# Altium schematic sheet Communication.SchDoc
size 420 x 297 mm; SheetNumber: 3; SheetTotal: 6
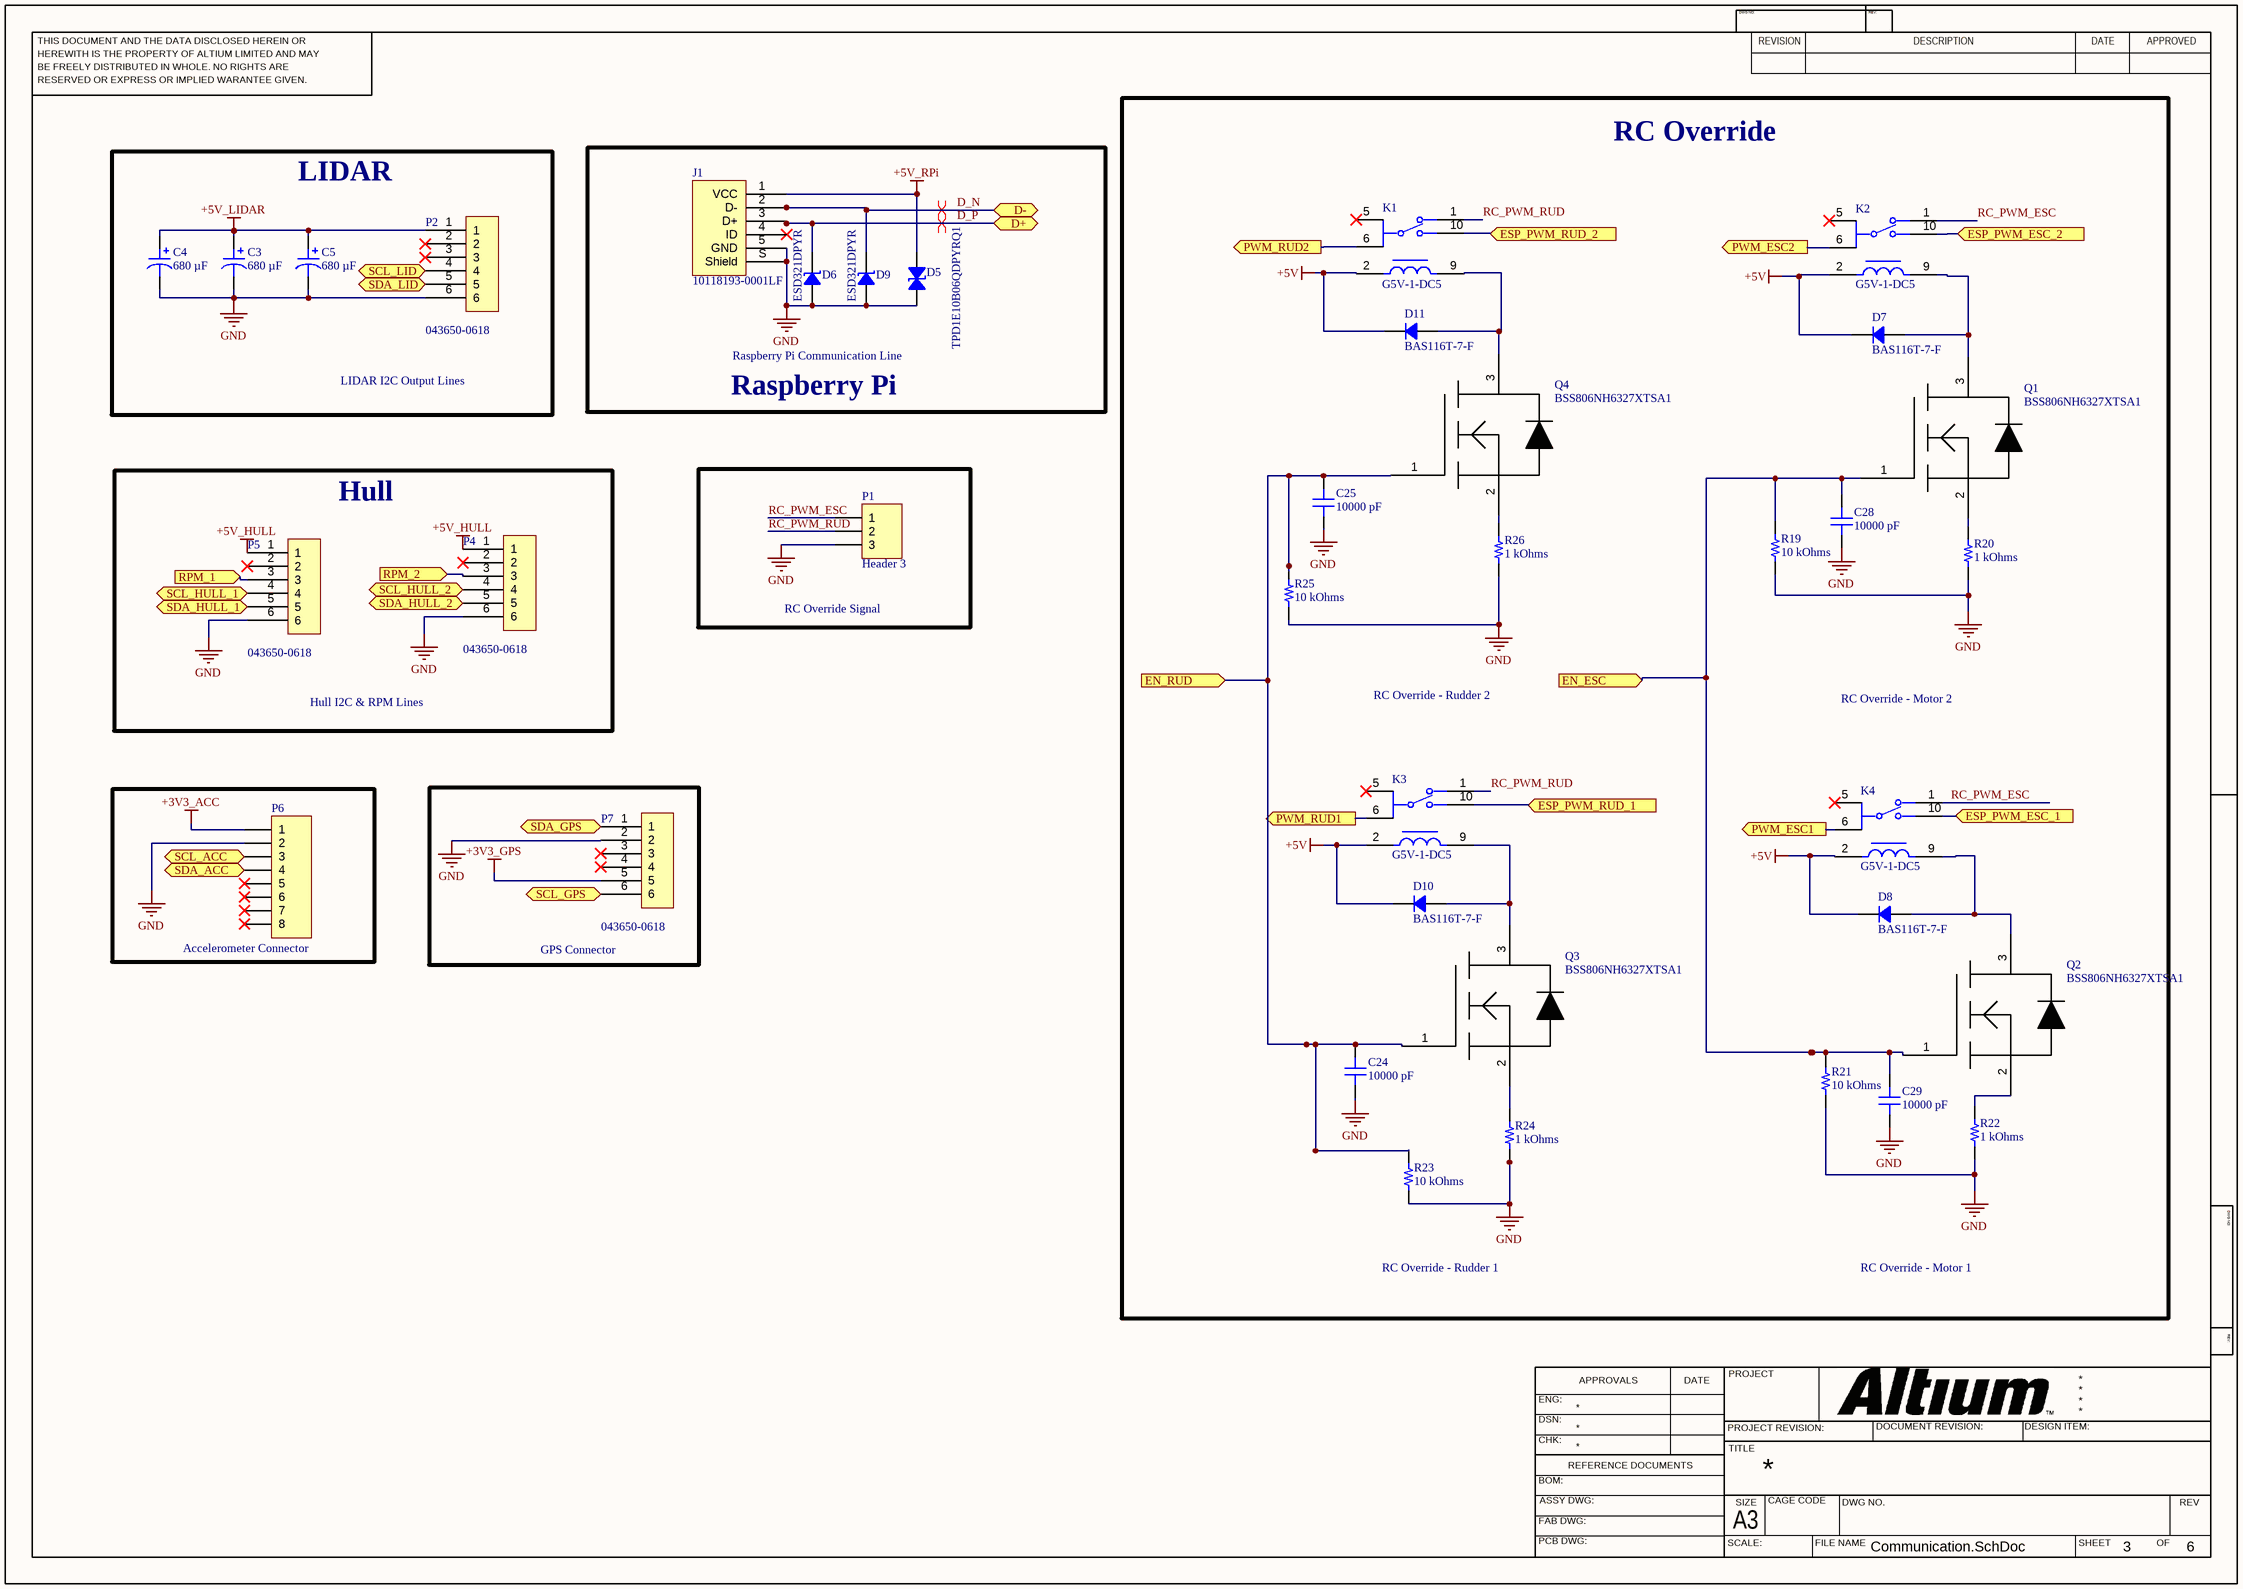
[diagram p0: Communication.SchDoc]

## Parts
C3  680 µF  [CAP ALSMD 8.3MM H10.5MM]
C4  680 µF  [CAP ALSMD 8.3MM H10.5MM]
C5  680 µF  [CAP ALSMD 8.3MM H10.5MM]
C24  10000 pF  [CAP 0603_1608]
C25  10000 pF  [CAP 0603_1608]
C28  10000 pF  [CAP 0603_1608]
C29  10000 pF  [CAP 0603_1608]
D5  TPD1E10B06QDPYRQ1  [0402]
D6  ESD321DPYR  [0402]
D7  BAS116T-7-F  [DIODES SOT-523]
D8  BAS116T-7-F  [DIODES SOT-523]
D9  ESD321DPYR  [0402]
D10  BAS116T-7-F  [DIODES SOT-523]
D11  BAS116T-7-F  [DIODES SOT-523]
J1  10118193-0001LF  [FCI USB 10118193-0001LF]
K1  G5V-1-DC5  [FP-G5V-1-MFG]
K2  G5V-1-DC5  [FP-G5V-1-MFG]
K3  G5V-1-DC5  [FP-G5V-1-MFG]
K4  G5V-1-DC5  [FP-G5V-1-MFG]
P1  Header 3  [HDR1X3]
P2  043650-0618  [043650-0618-Footprint-1]
P4  043650-0618  [043650-0618-Footprint-1]
P5  043650-0618  [043650-0618-Footprint-1]
P6  Accelerometer Connector  [HDR1X8]
P7  043650-0618  [043650-0618-Footprint-1]
Q1  BSS806NH6327XTSA1  [SOT95P255X100-3N]
Q2  BSS806NH6327XTSA1  [SOT95P255X100-3N]
Q3  BSS806NH6327XTSA1  [SOT95P255X100-3N]
Q4  BSS806NH6327XTSA1  [SOT95P255X100-3N]
R19  10 kOhms  [RES 0603_1608]
R20  1 kOhms  [RES 0603_1608]
R21  10 kOhms  [RES 0603_1608]
R22  1 kOhms  [RES 0603_1608]
R23  10 kOhms  [RES 0603_1608]
R24  1 kOhms  [RES 0603_1608]
R25  10 kOhms  [RES 0603_1608]
R26  1 kOhms  [RES 0603_1608]

## Blocks framed on the sheet
RC Override: C24 C25 C28 C29 D7 D8 D10 D11 K1-K4 Q1-Q4 R19-R26
LIDAR: C3-C5 P2
Raspberry Pi: D5 D6 D9 J1
Hull: P4 P5
RC Override Signal: P1
GPS Connector: P7

## Ports
D+ (bidir), D- (bidir), EN_ESC (in), EN_RUD (in), ESP_PWM_ESC_1 (in), ESP_PWM_ESC_2 (in), ESP_PWM_RUD_1 (in), ESP_PWM_RUD_2 (in), PWM_ESC1 (out), PWM_ESC2 (out), PWM_RUD1 (out), PWM_RUD2 (out), RPM_1 (in), RPM_2 (in), SCL_ACC (bidir), SCL_GPS (bidir), SCL_HULL_1 (bidir), SCL_HULL_2 (bidir), SCL_LID (bidir), SDA_ACC (bidir), SDA_GPS (bidir), SDA_HULL_1 (bidir), SDA_HULL_2 (bidir), SDA_LID (bidir)

## Nets
+3V3_ACC: P6.1
+3V3_GPS: P7.5
+5V: D7.2 D8.2 D10.2 D11.2 K1.2 K2.2 K3.2 K4.2
+5V_HULL: P4.1 P5.1
+5V_LIDAR: C3.1 C4.1 C5.1 P2.1
+5V_RPi: D5.1 J1.1(VCC)
GND: C3.2 C4.2 C5.2 C24.2 C25.2 C28.2 C29.2 D5.2 D6.1 D9.1 J1.5(GND) J1.S(Shield) P1.3 P2.6 P4.6 P5.6 P6.2 P7.2 R19.1 R20.1 R21.1 R22.1 R23.1 R24.1 R25.1 R26.1
D_N: D9.2 J1.2(D-) ; port D-
D_P: D6.2 J1.3(D+) ; port D+
EN_ESC: C28.1 C29.1 Q1.1(GATE) Q2.1(GATE) R19.2 R21.2 ; port EN_ESC
EN_RUD: C24.1 C25.1 Q3.1(GATE) Q4.1(GATE) R23.2 R25.2 ; port EN_RUD
ESP_PWM_ESC_1: K4.10 ; port ESP_PWM_ESC_1
ESP_PWM_ESC_2: K2.10 ; port ESP_PWM_ESC_2
ESP_PWM_RUD_1: K3.10 ; port ESP_PWM_RUD_1
ESP_PWM_RUD_2: K1.10 ; port ESP_PWM_RUD_2
PWM_ESC1: K4.6 ; port PWM_ESC1
PWM_ESC2: K2.6 ; port PWM_ESC2
PWM_RUD1: K3.6 ; port PWM_RUD1
PWM_RUD2: K1.6 ; port PWM_RUD2
RC_PWM_ESC: K2.1 K4.1 P1.1
RC_PWM_RUD: K1.1 K3.1 P1.2
RPM_1: P5.3 ; port RPM_1
RPM_2: P4.3 ; port RPM_2
SCL_ACC: P6.3 ; port SCL_ACC
SCL_GPS: P7.6 ; port SCL_GPS
SCL_HULL_1: P5.4 ; port SCL_HULL_1
SCL_HULL_2: P4.4 ; port SCL_HULL_2
SCL_LID: P2.4 ; port SCL_LID
SDA_ACC: P6.4 ; port SDA_ACC
SDA_GPS: P7.1 ; port SDA_GPS
SDA_HULL_1: P5.5 ; port SDA_HULL_1
SDA_HULL_2: P4.5 ; port SDA_HULL_2
SDA_LID: P2.5 ; port SDA_LID
NetD7_1: D7.1 K2.9 Q1.3(DRAIN)
NetD8_1: D8.1 K4.9 Q2.3(DRAIN)
NetD10_1: D10.1 K3.9 Q3.3(DRAIN)
NetD11_1: D11.1 K1.9 Q4.3(DRAIN)
NetQ1_2: Q1.2(SOURCE) R20.2
NetQ2_2: Q2.2(SOURCE) R22.2
NetQ3_2: Q3.2(SOURCE) R24.2
NetQ4_2: Q4.2(SOURCE) R26.2

Not connected (* = marked no-connect by the designer): J1 4(ID)*; K1 5*; K2 5*; K3 5*; K4 5*; P2 2* 3*; P4 2*; P5 2*; P6 5* 6* 7* 8*; P7 3* 4*

## Layout directives
differential pair: D_N, D_P

## Notes on the sheet
- LIDAR I2C Output Lines
- Raspberry Pi Communication Line
- Hull I2C & RPM Lines
- RC Override - Rudder 2
- RC Override - Motor 2
- RC Override - Rudder 1
- RC Override - Motor 1
- THIS DOCUMENT AND THE DATA DISCLOSED HEREIN OR
- HEREWITH IS THE PROPERTY OF ALTIUM LIMITED AND MAY
- DWG NO:
- REVISION
- REV:
- DESCRIPTION
- DATE
- APPROVED
- BE FREELY DISTRIBUTED IN WHOLE. NO RIGHTS ARE
- RESERVED OR EXPRESS OR IMPLIED WARANTEE GIVEN.
- ENG:
- APPROVALS
- PROJECT
- DSN:
- CHK:
- REFERENCE DOCUMENTS
- PROJECT REVISION:
- TITLE
- DOCUMENT REVISION:
- DESIGN ITEM:
- BOM:
- FAB DWG:
- PCB DWG:
- ASSY DWG:
- SCALE:
- A3
- SIZE
- CAGE CODE
- FILE NAME
- DWG NO.
- SHEET
- OF
- REV

## Library data of the parts
C3-C5 = EEE-FK1A681P: CAP ALUM 680UF 20% 10V SMD; manufacturer: Panasonic Electronic Components; Impedance: 160 mOhms; Lifetime @ Temp.: 2000 Hrs @ 105°C; Polarization: Polar; Ripple Current @ High Frequency: 600 mA @ 100 kHz; Ripple Current @ Low Frequency: 450 mA @ 120 Hz; Surface Mount Land Size: 0.327" L x 0.327" W (8.30mm x 8.30mm); Part Number: EEE-FK1A681P; Applications: Automotive; Capacitance: 680 µF; componentlink2description: DigiKey Link; componentlink2url: https://www.digikey.com/en/products/detail/panasonic-electronic-components/EEE-FK1A681P/765951; Device Package: Radial, Can - SMD; Height - Seated (Max): 0.413" (10.50mm); lastupdated: 3/4/2022 6:18:28 PM; Lifecycle Status: Active; Minimum Order: 1; Mounting Type: Surface Mount; Operating Temperature: -55°C ~ 105°C; Package / Case: Radial, Can - SMD; packaging: TapeAndReel; partid: 7615; Part Status: Active; price: 0.34; Ratings: AEC-Q200; series: FK; Size / Dimension: 0.315" Dia (8.00mm); Supplier 1: DigiKey; Supplier Part Number 1: PCE3781CT-ND; Tolerance: ±20%; value: 680 µF; Voltage - Rated: 10 V
C24 C25 C28 C29 = C0603C103K4RECAUTO: CAP CER 0603 10NF 16V X7R 10%; manufacturer: KEMET; Part Number: C0603C103K4RECAUTO; Value: 10000 pF; Applications: Automotive, ESD Protection; Capacitance: 10000 pF; componentlink1description: Datasheet; componentlink1url: https://api.kemet.com/component-edge/download/datasheet/C0603C103K4RECAUTO.pdf; componentlink2description: DigiKey Link; componentlink2url: https://www.digikey.com/en/products/detail/kemet/C0603C103K4RECAUTO/8640474; Device Package: 0603 (1608 Metric); lastupdated: 2022-06-14 2:44:13 AM; Lifecycle Status: Active; Minimum Order: 1; Mounting Type: Surface Mount, MLCC; Operating Temperature: -55°C ~ 125°C; Package / Case: 0603 (1608 Metric); packaging: TapeAndReel; partid: 8251; Part Status: Active; price: 0.02; Ratings: AEC-Q200; series: ESD SMD Auto X7R; Size / Dimension: 0.063" L x 0.031" W (1.60mm x 0.80mm); Supplier 1: DigiKey; Supplier Part Number 1: 399-17880-1-ND; Temperature Coefficient: X7R; Thickness (Max): 0.034" (0.87mm); Tolerance: ±10%; Voltage - Rated: 16V
D5 = TPD1E10B06QDPYRQ1: TVS DIODE 5.5VWM 14VC 2X1SON; Manufacturer: Texas Instruments; Bidirectional Channels: 1; Capacitance @ Frequency: 12pF @ 1MHz; Current - Peak Pulse (10/1000µs): 6A (8/20µs); Power Line Protection: No; Power - Peak Pulse: 90W; Type: Zener; Voltage - Breakdown (Min): 6V; Voltage - Clamping (Max) @ Ipp: 14V (Typ); Voltage - Reverse Standoff (Typ): 5.5V (Max); Part Number: TPD1E10B06QDPYRQ1; Applications: Automotive; ComponentLink1Description: Datasheet; ComponentLink1URL: http://www.ti.com/general/docs/suppproductinfo.tsp?distId=10&gotoUrl=http%3A%2F%2Fwww.ti.com%2Flit%2Fgpn%2Ftpd1e10b06-q1; ComponentLink2Description: DigiKey Link; ComponentLink2URL: https://www.digikey.com/en/products/detail/texas-instruments/TPD1E10B06QDPYRQ1/6609845; Device Package: 0402 (1005 Metric); LastUpdated: 2022-09-19 2:05:54 PM; Lifecycle Status: Active; Minimum Order: 1; Mounting Type: Surface Mount; Operating Temperature: -40°C ~ 125°C (TA); Package / Case: 0402 (1005 Metric); Packaging: TapeAndReel; PartId: 10475; Part Status: Active; Price: 0.09; Series: Automotive, AEC-Q101; Supplier 1: DigiKey; Supplier Part Number 1: 296-TPD1E10B06QDPYRQ1CT-ND; Supplier Device Package: 2-X1SON (1x.60)
D6 D9 = ESD321DPYR: TVS DIODE 3.6VWM 6.8VC 2X1SON; Manufacturer: Texas Instruments; Capacitance @ Frequency: 0.9pF @ 1MHz; Current - Peak Pulse (10/1000µs): 6A (8/20µs); Power Line Protection: No; Power - Peak Pulse: 40W; Type: Zener; Unidirectional Channels: 1; Voltage - Breakdown (Min): 4.5V; Voltage - Clamping (Max) @ Ipp: 6.8V (Typ); Voltage - Reverse Standoff (Typ): 3.6V (Max); Part Number: ESD321DPYR; Applications: General Purpose; ComponentLink1Description: Datasheet; ComponentLink1URL: http://www.ti.com/general/docs/suppproductinfo.tsp?distId=10&gotoUrl=http%3A%2F%2Fwww.ti.com%2Flit%2Fgpn%2Fesd321; ComponentLink2Description: DigiKey Link; ComponentLink2URL: https://www.digikey.com/en/products/detail/texas-instruments/ESD321DPYR/9559035; Device Package: 0402 (1005 Metric); LastUpdated: 2022-09-19 2:05:48 PM; Lifecycle Status: Active; Minimum Order: 1; Mounting Type: Surface Mount; Operating Temperature: -40°C ~ 125°C (TA); Package / Case: 0402 (1005 Metric); Packaging: TapeAndReel; PartId: 11534; Part Status: Active; Price: 0.10; Series: -; Supplier 1: DigiKey; Supplier Part Number 1: 296-51108-1-ND; Supplier Device Package: 2-X1SON (1x.60)
D7 D8 D10 D11 = BAS116T-7-F: DIODE GEN PURP 85V 215MA SOT523; Manufacturer: Diodes Incorporated; Current - Average Rectified (Io): 215mA (DC); Current - Reverse Leakage @ Vr: 5nA @ 75V; Diode Type: Standard; Reverse Recovery Time (trr): 3µs; Speed: Standard Recovery >500ns, > 200mA (Io); Voltage - Forward (Vf) (Max) @ If: 1.25V @ 150mA; Part Number: BAS116T-7-F; ComponentLink1Description: Datasheet; ComponentLink1URL: https://www.diodes.com/assets/Datasheets/ds30258.pdf; ComponentLink2Description: DigiKey Link; ComponentLink2URL: http://digikey.com/product-detail/en/diodes-incorporated/BAS116T-7-F/BAS116T-FDICT-ND/815338; LastUpdated: 4/12/2022 10:52:55 PM; Lifecycle Status: Active; Minimum Order: 1; Mounting Type: Surface Mount; Operating Temperature - Junction: -65°C ~ 150°C; Package / Case: SOT-523; Packaging: TapeAndReel; PartId: 1; Part Status: Active; Price: 0.06; Series: -; Supplier 1: DigiKey; Supplier Part Number 1: BAS116T-FDICT-ND; Supplier Device Package: SOT-523; Voltage - DC Reverse (Vr) (Max): 85V
J1 = 10118193-0001LF: CONN RCPT USB2.0 MICRO B SMD R/A; Manufacturer: Amphenol ICC (FCI); Connector Type: USB - micro B; Current Rating (Amps): 1.8A per Contact; Gender: Receptacle; Mating Cycles: 10000; Number of Contacts: 5; Number of Ports: 1; Shielding: Shielded; Voltage - Rated: 100VAC; Part Number: 10118193-0001LF; ComponentLink1Description: Datasheet; ComponentLink1URL: https://cdn.amphenol-icc.com/media/wysiwyg/files/documentation/datasheet/inputoutput/io_usb_micro.pdf; ComponentLink2Description: DigiKey Link; ComponentLink2URL: //digikey.com/product-detail/en/amphenol-icc-fci/10118193-0001LF/609-4616-2-ND/2785388; Features: Solder Retention; LastUpdated: 2019-12-09 8:51:28 PM; Lifecycle Status: 0; Minimum Order: 1; Mounting Feature: Horizontal; Mounting Type: Surface Mount, Right Angle; Through Hole; Operating Temperature: -30°C ~ 80°C; Packaging: TapeAndReel; Part Status: Active; Price: 0.21; Series: -; Specifications: USB 2.0; Supplier 1: DigiKey; Supplier Part Number 1: 609-4616-2-ND; Termination: Solder
K1-K4 = CMP-2000-05293-2: RELAY GEN PURPOSE SPDT 1A 5VDC; Manufacturer: Omron; Coil Power: 150mW; Coil Voltage: 5V; Standoff Height: 0.5mm; Coil Type: Non-Latching; Coil Resistance: 167Ω; Number Of Contacts: 1; Coil Current: 30mA; Current Rating: 2A; Temperature: -40°C to +70°C; Manufacturer Part Number: G5V-1-DC5; Lead Free: Yes; RoHS: TRUE; Category: Relay; ComponentLink2Description: Datasheet; Ambient Temperature Range Low: -40°C; Digikey Description: RELAY GEN PURPOSE SPDT 1A 5VDC; Temperature Range High: +70°C; Package: G5V-1; Throw Configuration: SPDT; Switching Current: 1A; Height: 10mm; Device Class L2: Relays; Ambient Temperature Range High: +70°C; Temperature Range Low: -40°C; Octopart: https://octopart.com/g5v-1-dc5-omron-6846; Device Class L1: Electromechanical; ComponentLink2URL: https://omronfs.omron.com/en_US/ecb/products/pdf/en-g5v_1.pdf; Automotive: No; Device Class L3: Signal Relays
P1 = Header 3: Header, 3-Pin; LatestRevisionDate: 17-Jul-2002; LatestRevisionNote: Re-released for DXP Platform.; Publisher: Altium Limited
P2 P4 P5 P7 = CMP-00026-1: Conn Power HDR 6 POS 3mm Solder ST Thru-Hole 6 Terminal 1 Port Micro-Fit 3.0™ Tray; Number of Ports: 1; Number of Contacts: 6; Connector Type: Male Pin; RoHS Compliant: Yes; Termination: Solder; Contact Plating: Tin; Orientation: Straight; Packaging: Tray; Length: 21.64mm; Number of Terminals/Pins: 6; Number of Positions: 6; Min Operating Temperature: -40°C; Fastening Type: Ramp; Contact Material: Brass; Depth: 5.57mm; Pitch: 3mm; Housing Material: Polymer; Max Operating Temperature: 105°C; Color: Black; Mount: Through Hole; Package Quantity: 1530; Number of Rows: 1
P6 = Header 8: Header, 8-Pin; LatestRevisionDate: 17-Jul-2002; LatestRevisionNote: Re-released for DXP Platform.; Publisher: Altium Limited
Q1-Q4 = CMP-00034-3: Single N-Channel 20 V 57 mOhm 1.7 nC OptiMOS Small Signal Mosfet - SOT-23; Rise Time: 9.9ns; Gate to Source Voltage (Vgs): 8V; Drain to Source Voltage (Vdss): 20V; Rds On Max: 57mR; Continuous Drain Current (ID): 2.3A; Max Power Dissipation: 500mW; Input Capacitance: 529pF; RoHS Compliant: Yes; Packaging: Cut Tape; Min Operating Temperature: -55°C; Halogen Free: Halogen Free; Mount: Surface Mount; Max Operating Temperature: 150°C; Max Dual Supply Voltage: 20V; Case/Package: SOT-23; Series: OptiMOS™; Lead Free: Lead Free
R19 R21 R23 R25 = RNCS0603BKE10K0: RES 10K OHM 0.1% 1/16W 0603; Manufacturer: Stackpole Electronics Inc; Power (Watts): 0.063W, 1/16W; Temperature Coefficient: ±25ppm/°C; Part Number: RNCS0603BKE10K0; Value: 10 kOhms; ComponentLink1Description: Datasheet; ComponentLink1URL: https://www.seielect.com/catalog/sei-rncs_rnch.pdf; ComponentLink2Description: DigiKey Link; ComponentLink2URL: https://www.digikey.com/en/products/detail/stackpole-electronics-inc/RNCS0603BKE10K0/1708836; Composition: Thin Film; Device Package: 0603 (1608 Metric); Features: Anti-Corrosive, Automotive AEC-Q200, Moisture Resistant; Height - Seated (Max): 0.022" (0.55mm); LastUpdated: 4/12/2022 10:27:55 PM; Lifecycle Status: Active; Minimum Order: 1; Number of Terminations: 2; Operating Temperature: -55°C ~ 155°C; Package / Case: 0603 (1608 Metric); Packaging: TapeAndReel; PartId: 4838; Part Status: Active; Price: 0.08; Ratings: AEC-Q200; Resistance: 10 kOhms; Series: RNCS; Size / Dimension: 0.061" L x 0.031" W (1.55mm x 0.80mm); Supplier 1: DigiKey; Supplier Part Number 1: RNCS0603BKE10K0CT-ND; Supplier Device Package: 0603; Tolerance: ±0.1%
R20 R22 R24 R26 = RNCS0603BKE10K0: RES 10K OHM 0.1% 1/16W 0603; Manufacturer: Stackpole Electronics Inc; Power (Watts): 0.063W, 1/16W; Resistance: 10 kOhms; Temperature Coefficient: ±25ppm/°C; Part Number: RNCS0603BKE10K0; Value: 1 kOhms; ComponentLink1Description: Datasheet; ComponentLink1URL: https://www.seielect.com/catalog/sei-rncs_rnch.pdf; ComponentLink2Description: DigiKey Link; ComponentLink2URL: https://www.digikey.com/en/products/detail/stackpole-electronics-inc/RNCS0603BKE10K0/1708836; Composition: Thin Film; Device Package: 0603 (1608 Metric); Features: Anti-Corrosive, Automotive AEC-Q200, Moisture Resistant; Height - Seated (Max): 0.022" (0.55mm); LastUpdated: 4/12/2022 10:27:55 PM; Lifecycle Status: Active; Minimum Order: 1; Number of Terminations: 2; Operating Temperature: -55°C ~ 155°C; Package / Case: 0603 (1608 Metric); Packaging: TapeAndReel; PartId: 4838; Part Status: Active; Price: 0.08; Ratings: AEC-Q200; Series: RNCS; Size / Dimension: 0.061" L x 0.031" W (1.55mm x 0.80mm); Supplier 1: DigiKey; Supplier Part Number 1: RNCS0603BKE10K0CT-ND; Supplier Device Package: 0603; Tolerance: ±0.1%